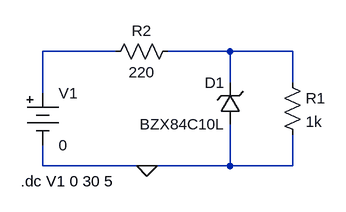
[diagram p0: schematic EXP-2_LineRegulator.asc]
EXP-2_LineRegulator.asc, the LTspice schematic file:
Version 4
SHEET 1 880 680
WIRE 192 48 80 48
WIRE 368 48 272 48
WIRE 464 48 368 48
WIRE 368 96 368 48
WIRE 464 96 464 48
WIRE 80 112 80 48
WIRE 80 224 80 192
WIRE 240 224 80 224
WIRE 368 224 368 160
WIRE 368 224 240 224
WIRE 464 224 464 176
WIRE 464 224 368 224
FLAG 240 224 0
SYMBOL Misc\\battery 80 96 R0
WINDOW 123 0 0 Left 0
WINDOW 39 0 0 Left 0
SYMATTR InstName V1
SYMATTR Value 0
SYMBOL res 448 80 R0
SYMATTR InstName R1
SYMATTR Value 1k
SYMBOL res 288 32 R90
WINDOW 0 0 56 VBottom 2
WINDOW 3 32 56 VTop 2
SYMATTR InstName R2
SYMATTR Value 220
SYMBOL zener 384 160 R180
WINDOW 0 24 64 Left 2
WINDOW 3 24 0 Left 2
SYMATTR InstName D1
SYMATTR Value BZX84C10L
TEXT 46 248 Left 2 !.dc V1 0 30 5

The netlist it stands for:
* EXP-2_LineRegulator.asc
V1 N001 0 0
R1 N002 0 1k
R2 N002 N001 220
D1 0 N002 BZX84C10L
.model D D
.lib standard.dio
.dc V1 0 30 5
.backanno
.end